# EAGLE design MCT-1601-ss (EAGLE 7.6.0)
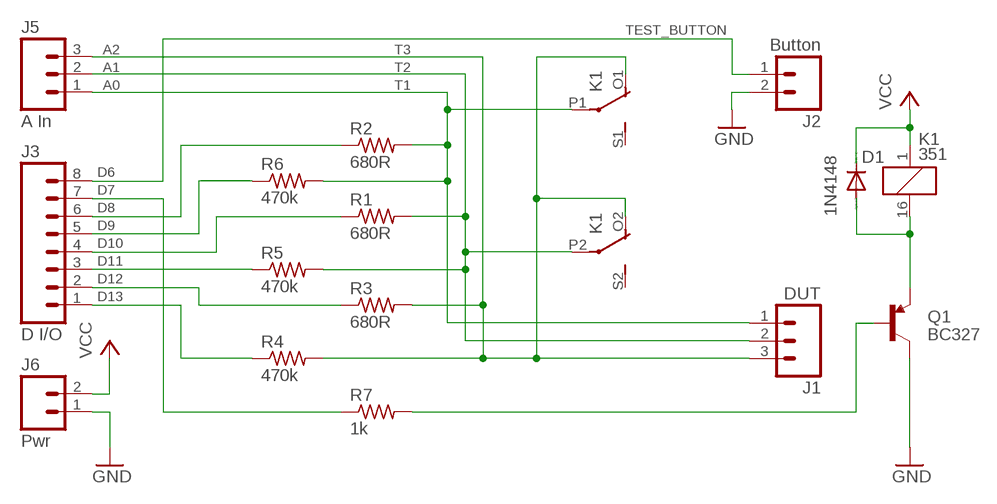
[diagram p0: schematic, sheet 1]

## Parts
D1  1N4148  DIODE-D-2.5  [D-2.5]
J1  DUT  M03PTH  [1X03]
J2  Button  M02PTH  [1X02]
J3  D I/O  M08  [1X08_ROUND]
J5  A In  M03PTH  [1X03]
J6  Pwr  M02PTH  [1X02]
K1  351  [351]
Q1  BC327  SS-PNP-BC327  [TO-92]
R1  680R  R-US_0204/5  [0204/5]
R2  680R  R-US_0204/5  [0204/5]
R3  680R  R-US_0204/5  [0204/5]
R4  470k  R-US_0204/5  [0204/5]
R5  470k  R-US_0204/5  [0204/5]
R6  470k  R-US_0204/5  [0204/5]
R7  1k  R-US_0204/5  [0204/5]

## Nets
D7: J3.7 R7.1
D8: J3.6 R2.1
D9: J3.5 R6.1
D10: J3.4 R1.1
D11: J3.3 R5.1
D12: J3.2 R3.1
D13: J3.1 R4.1
GND: J2.2 J6.1 Q1.3(C)
N$2: Q1.2(B) R7.2
N$3: D1.A K1.16 Q1.1(E)
T1: J1.1 J5.1 K1.P1(2:P) R2.2 R6.2
T2: J1.2 J5.2 K1.P2(3:P) R1.2 R5.2
T3: J1.3 J5.3 K1.O1(2:O) K1.O2(3:O) R3.2 R4.2
TEST_BUTTON: J2.1 J3.8
VCC: D1.C J6.2 K1.1
Unconnected: K1.S1(2:S) K1.S2(3:S)

## Notes on the sheet
- A2
- A1
- A0
- D6

## Library data of the parts
D1 = diode:DIODE-: DIODE
J1 J5 = SparkFun-Connectors:M03: Header 3 Standard 3-pin 0.1" header. Use with straight break away headers (SKU : PRT-00116), right angle break away headers (PRT-00553), swiss pins (PRT-00743), machine pins (PRT-00117), and female headers (PRT-00115). Molex polarized connector foot print use with SKU : PRT-08232 with associated crimp pins and housings.
J2 J6 = SparkFun-Connectors:M02: Standard 2-pin 0.1" header. Use with - straight break away headers ( PRT-00116) - right angle break away headers (PRT-00553) - swiss pins (PRT-00743) - machine pins (PRT-00117) - female headers (PRT-00115) Molex polarized connector foot print use with: PRT-08233 with associated crimp pins and housings. 2.54_SCREWTERM for use with PRT-10571. 3.5mm Screw Terminal footprints for PRT-08084 5mm Screw Terminal footprints for use with PRT-08432
J3 = SparkFun-Connectors:M08: Header 8 Standard 8-pin 0.1" header. Use with straight break away headers (SKU : PRT-00116), right angle break away headers (PRT-00553), swiss pins (PRT-00743), machine pins (PRT-00117), and female headers (PRT-00115).; PROD_ID: CONN-08437
K1 = relay:351: RELAY 2 x switch, Omron; OC_FARNELL: unknown; OC_NEWARK: unknown
Q1 = 00 Nik misc:SS-PNP-: BC327/807 PNP BJT
R1-R7 = resistor:R-US_: RESISTOR, American symbol

## Board
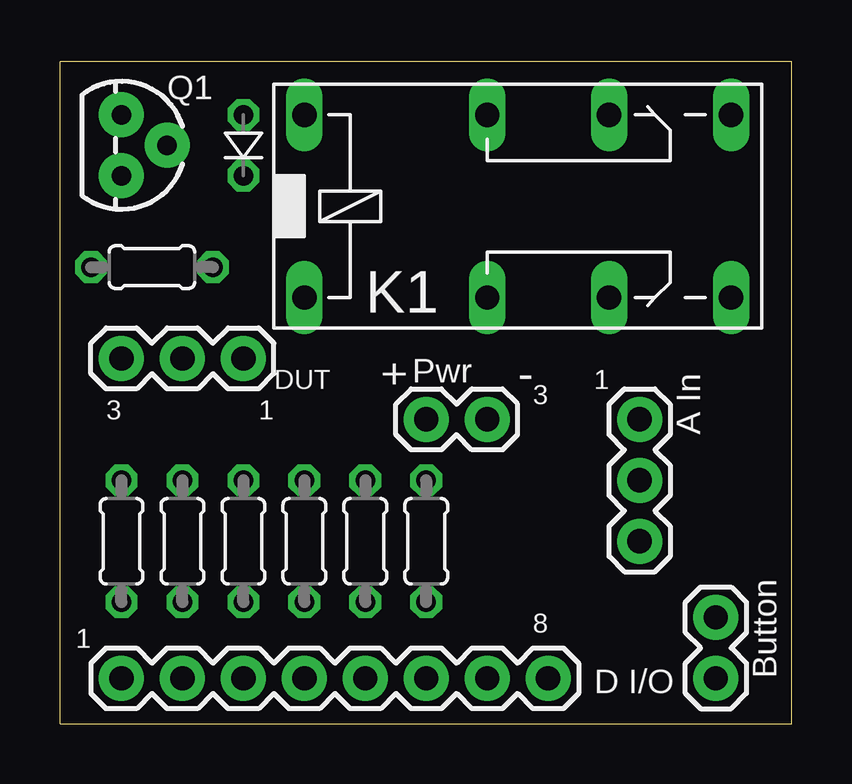
[diagram p1: board, top side]
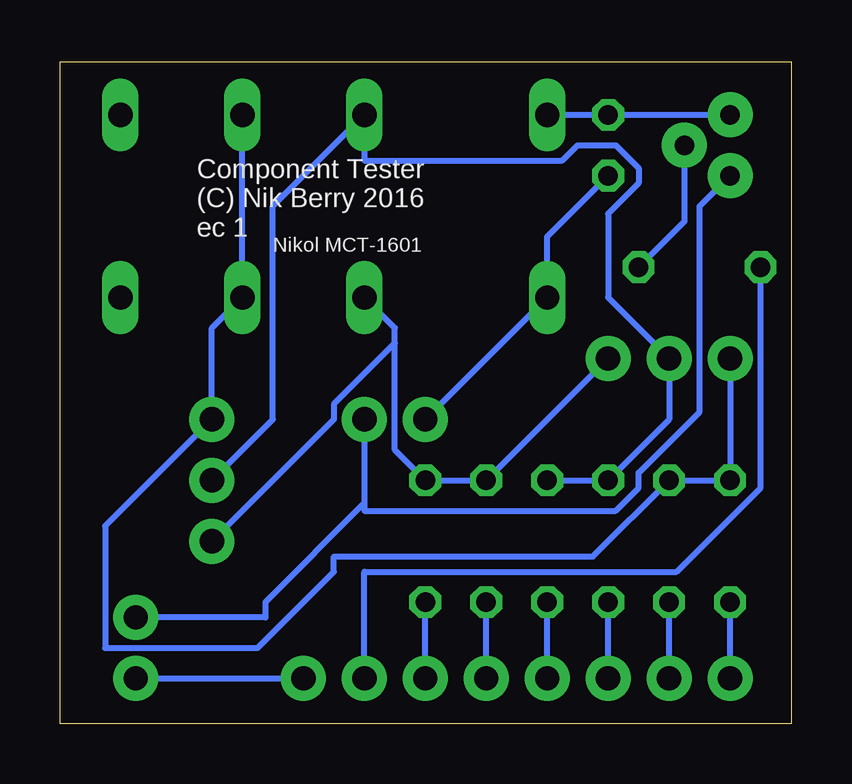
[diagram p2: board, bottom side, seen from below]

Size 30.48 x 27.61 mm. Coordinates in mm from the lower left corner, seen from the top.
Outline: 0.02,0 30.48,0 30.48,27.61 0.02,27.61
Outline: 0,0 0,27.61
Copper layers (1*16): Top 0.035mm / dielectric 1.5mm / Bottom 0.035mm
Design rules "default": minimum track width 10mil, minimum drill 24mil, track to track 8mil, track to pad 8mil, pad to pad 8mil, via to via 8mil, smd to smd 8mil, copper to edge 40mil, drill to drill 8mil, minimum pad ring 10mil, minimum via ring 8mil, stop-mask expansion 4mil, vias tented up to drill 0mil, thermal gap 10mil

### Footprints (pad centres in the part's own frame; a part is rotated, then mirrored left to right if it is on the bottom)
D-2.5 = drill 0.813 octagon: A 1.27,0; C -1.27,0
1X03 = drill 1.016 pad 1.88: 1 0,0; 2 2.54,0; 3 5.08,0
1X02 = drill 1.016 pad 1.88: 1 0,0; 2 2.54,0
1X08_ROUND = drill 1.016 pad 1.88: 1 0,0; 2 2.54,0; 3 5.08,0; 4 7.62,0; 5 10.16,0; 6 12.7,0; 7 15.24,0; 8 17.78,0
351 = drill 1.016 long: 1 -3.81,-3.81; 16 -3.81,3.81; O1 8.89,-3.81; O2 8.89,3.81; P1 3.81,-3.81; P2 3.81,3.81; S1 13.97,-3.81; S2 13.97,3.81
TO-92 = drill 0.813 pad 1.88: 1 -1.27,0; 2 0,1.905; 3 1.27,0
0204/5 = drill 0.813 octagon: 1 -2.54,0; 2 2.54,0

### Placement (x,y rotation side)
D1  7.64,24.13 90 top
J1  7.64,15.24 180 top
J2  27.32,1.91 90 top
J3  2.56,1.91 0 top
J5  24.15,7.62 90 top
J6  17.8,12.7 180 top
K1  13.99,21.59 0 top
Q1  2.56,24.13 270 top
R1  10.18,7.62 90 top
R2  15.26,7.62 90 top
R3  5.1,7.62 90 top
R4  2.56,7.62 90 top
R5  7.64,7.62 90 top
R6  12.72,7.62 90 top
R7  3.83,19.05 0 top

### Tracks (layer width: path | path; a pad name or v marks a point on that pad's centre or on a via)
D7
  Bottom 0.254: R7.1 1.29,9.84 4.78,6.35 17.8,6.35 J3.7
D8
  Bottom 0.254: J3.6 R2.1
D9
  Bottom 0.254: J3.5 R6.1
D10
  Bottom 0.254: J3.4 R1.1
D11
  Bottom 0.254: J3.3 R5.1
D12
  Bottom 0.254: J3.2 R3.1
D13
  Bottom 0.254: J3.1 R4.1
GND
  Bottom 0.254: Q1.3 3.83,21.59 3.83,13.02 6.37,10.48 6.37,9.84 7.32,8.89 17.8,8.89 17.8,9.21 | J6.1 17.8,9.21 | J2.2 21.93,4.45 21.93,5.08 17.8,9.21
N$2
  Bottom 0.254: R7.2 4.46,20.95 Q1.2
N$3
  Bottom 0.254: K1.16 D1.A Q1.1
T1
  Bottom 0.254: K1.P1 16.53,16.51 16.53,15.88 | 16.53,15.88 16.53,11.43 R2.2 R6.2 J1.1 | J5.1 19.07,12.7 19.07,13.34 16.53,15.88
T2
  Bottom 0.254: R1.2 R5.2 5.1,12.7 J1.2 7.64,17.78 7.64,21.27 6.37,22.54 6.37,23.18 7.32,24.13 8.91,24.13 9.54,23.5 17.8,23.5 K1.P2 21.61,21.59 21.61,12.7 J5.2
T3
  Bottom 0.254: J1.3 R4.2 R3.2 8.28,6.99 19.07,6.99 19.07,6.35 22.25,3.17 28.59,3.17 28.59,8.26 J5.3 24.15,16.51 K1.O1 K1.O2
TEST_BUTTON
  Bottom 0.254: J2.1 J3.8
VCC
  Bottom 0.254: D1.C 10.18,20.32 K1.1 J6.2

### Text on the board
tNames: + | - | 1 | 3 | 1 | 3 | 8 | 1
bNames: Nikol MCT-1601 | Component Tester / (C) Nik Berry 2016 / ec 1